# Altium project LAUNCHXL-CC1310.PrjPcb (part 4 of 4)

## Sheet 3_Debugger Interface.SchDoc
size 420 x 297 mm
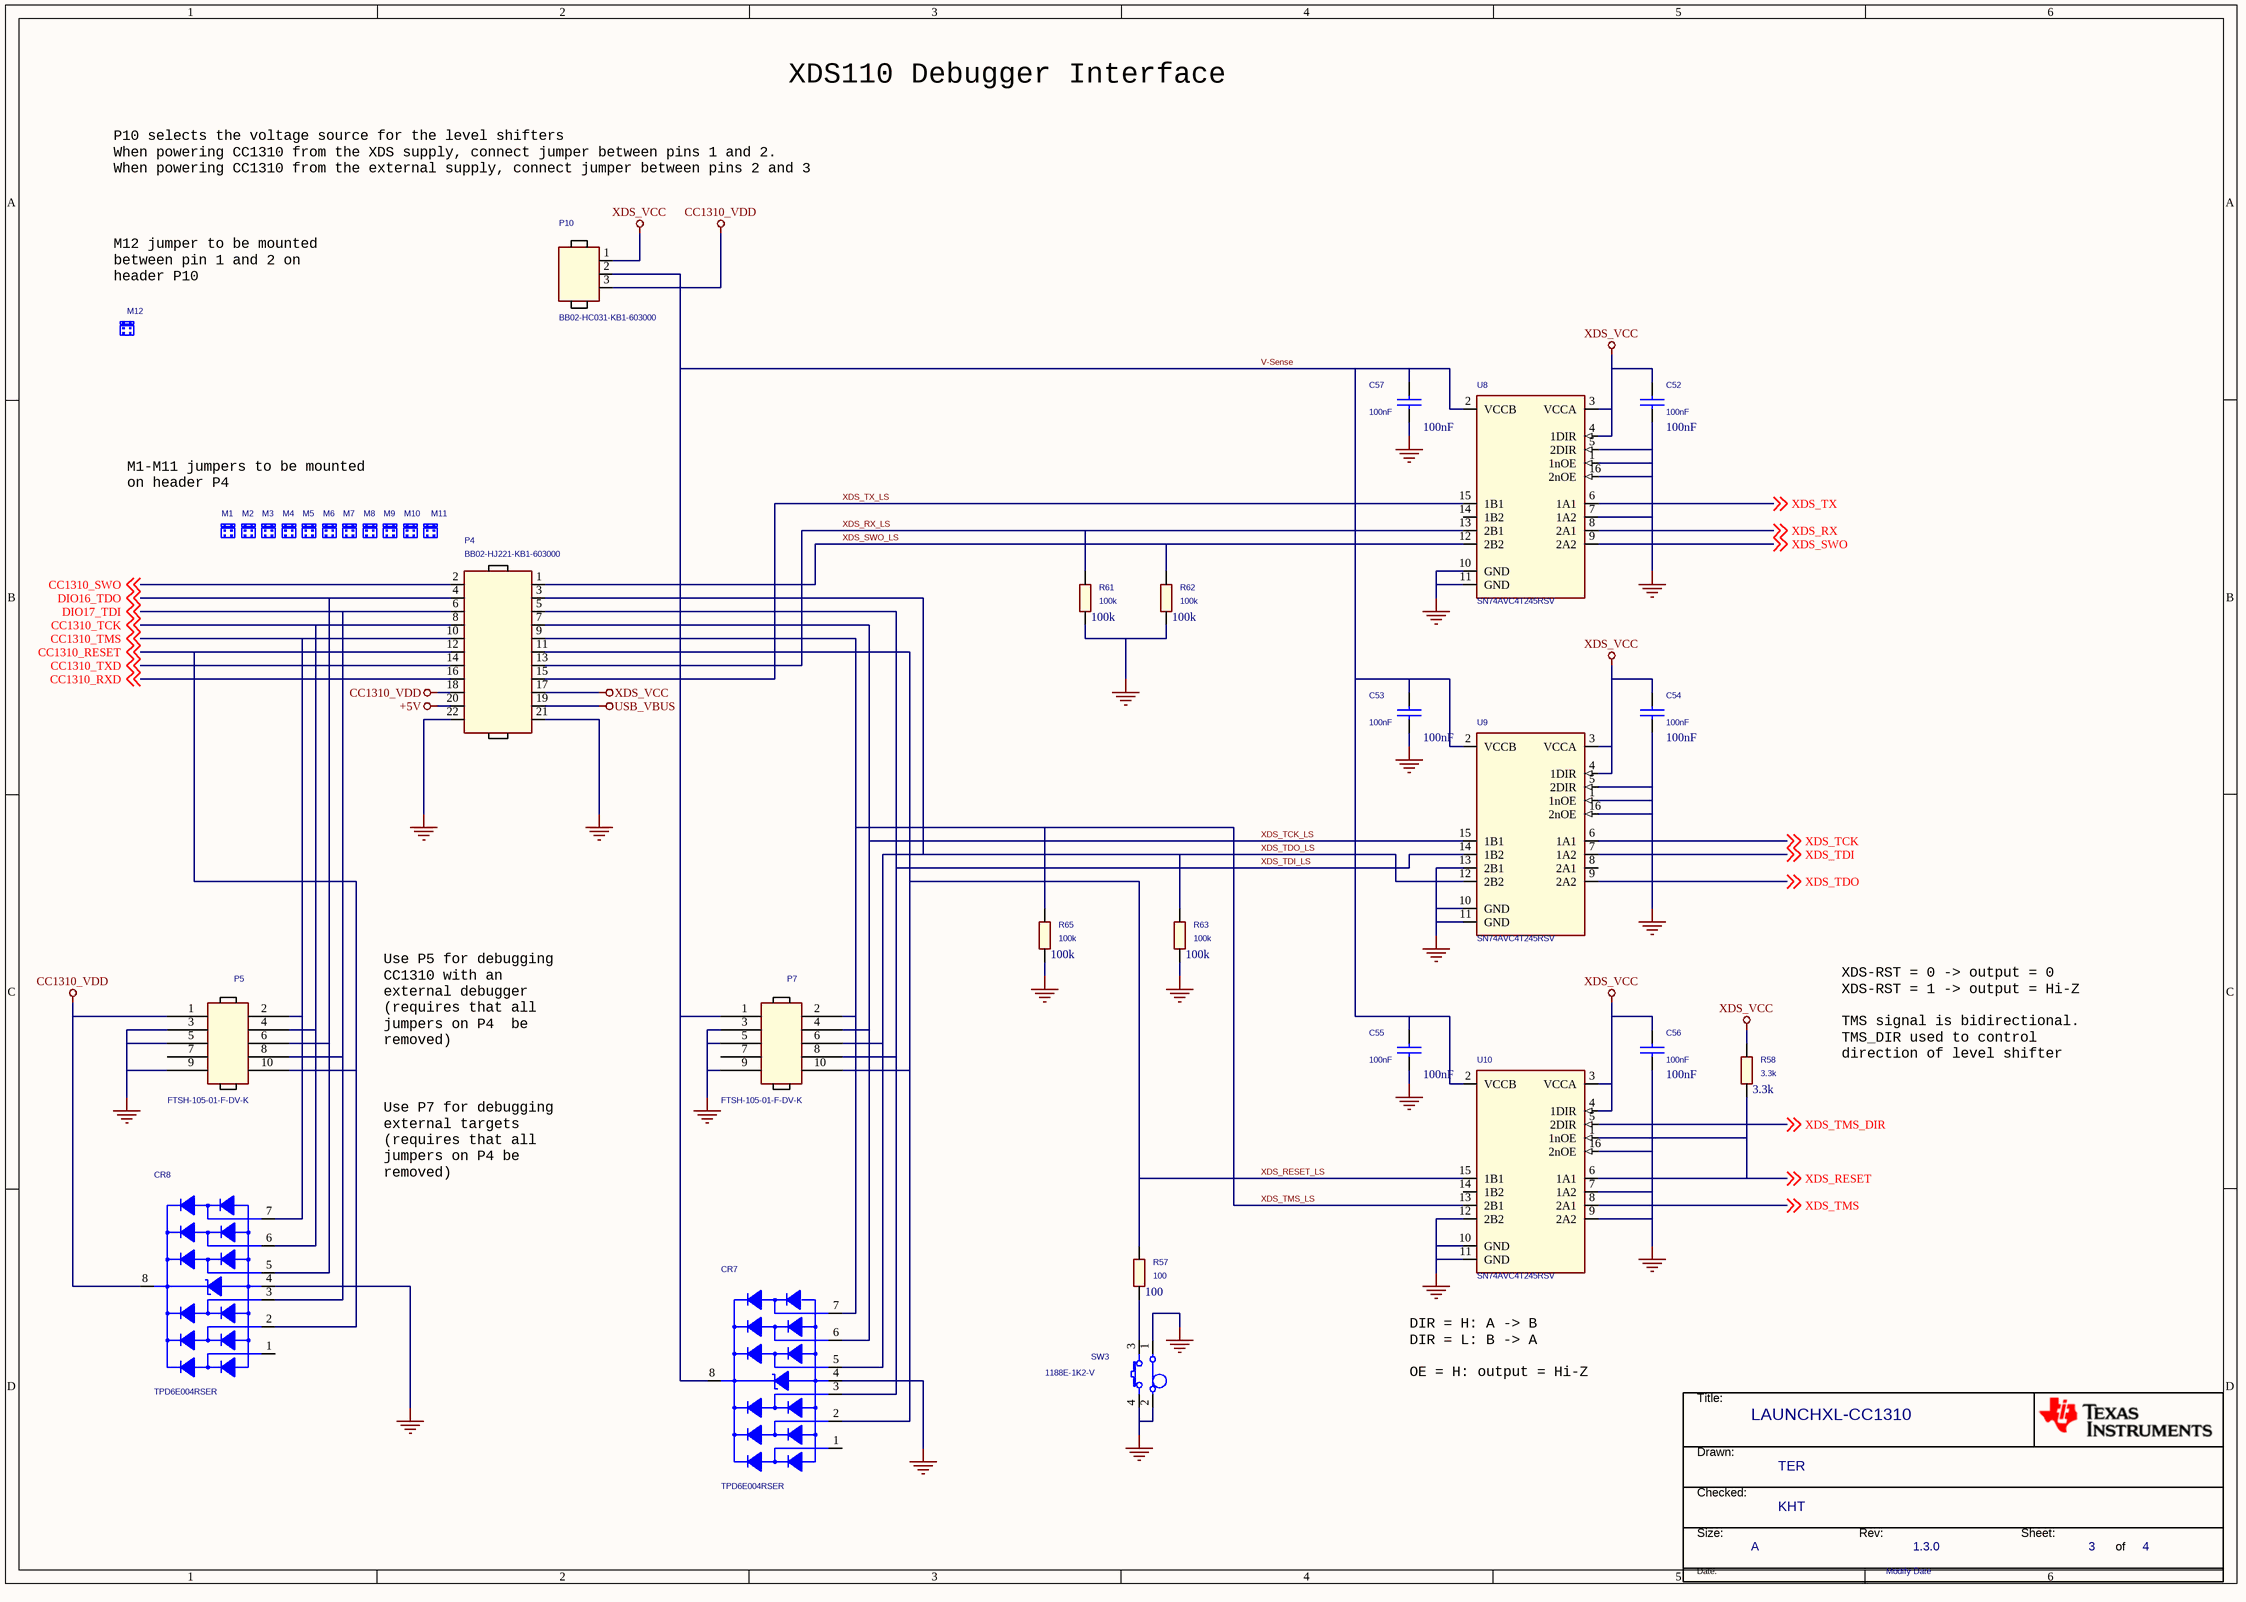
[diagram p3: 3_Debugger Interface.SchDoc]

### Parts
(Parts that share a designator on the sheet are numbered #1, #2 ... from top to bottom, then left to right.)
*#4  Designer name: KHT  Check name: TER  Design Modify Date: Modify Date  Page Size: A  RevCode: 1.3.0  Page Count: 4  Page Number: 3  Title: LAUNCHXL-CC1310  (hidden comment: TI_Norway_Title_Block)  (graphical)
C52  100nF  [CAPC1005X60B2N]
C53  100nF  [CAPC1005X60B2N]
C54  100nF  [CAPC1005X60B2N]
C55  100nF  [CAPC1005X60B2N]
C56  100nF  [CAPC1005X60B2N]
C57  100nF  [CAPC1005X60B2N]
CR7  TPD6E004RSER  [QFN50P150X150X60-8N]
CR8  TPD6E004RSER  [QFN50P150X150X60-8N]
M1  SNT-100-BK-G  (value not drawn)
M2  SNT-100-BK-G  (value not drawn)
M3  SNT-100-BK-G  (value not drawn)
M4  SNT-100-BK-G  (value not drawn)
M5  SNT-100-BK-G  (value not drawn)
M6  SNT-100-BK-G  (value not drawn)
M7  SNT-100-BK-G  (value not drawn)
M8  SNT-100-BK-G  (value not drawn)
M9  SNT-100-BK-G  (value not drawn)
M10  SNT-100-BK-G  (value not drawn)
M11  SNT-100-BK-G  (value not drawn)
M12  SNT-100-BK-G  (value not drawn)
P4  BB02-HJ221-KB1-603000  [GRADCONN_BB02HJ221KB160300_A2B]
P5  FTSH-105-01-F-DV-K  [SAMTEC_FTSH-105-01-F-DV-K-10L]
P7  FTSH-105-01-F-DV-K  [SAMTEC_FTSH-105-01-F-DV-K-10L]
P10  BB02-HC031-KB1-603000  [GRADCONN_BB02HC031KB1603000_A2B]
R57  100  [RESC1005X40B2N]
R58  3.3k  [RESC1005X40B2N]
R61  100k  [RESC1005X40B2N]
R62  100k  [RESC1005X40B2N]
R63  100k  [RESC1005X40B2N]
R65  100k  [RESC1005X40B2N]
SW3  1188E-1K2-V  [SW_1188E1K2V_A2N]
U8  SN74AVC4T245RSV  [QFNFC40P180X260X55-16A2L]
U9  SN74AVC4T245RSV  [QFNFC40P180X260X55-16A2L]
U10  SN74AVC4T245RSV  [QFNFC40P180X260X55-16A2L]

### Nets
+5V: P4.20
CC1310_VDD: CR8.8(VCC) P4.18 P5.1 P10.3
GND: C52.2 C53.2 C54.2 C55.2 C56.2 C57.2 CR7.4(GND) CR8.4(GND) P4.21 P4.22 P5.3 P5.5 P5.9 P7.3 P7.5 P7.9 R61.1 R62.1 R63.1 R65.1 SW3.1 SW3.2 SW3.4 U8.1(1nOE) U8.5(2DIR) U8.7(1A2) U8.10(GND) U8.11(GND) U8.16(2nOE) U9.1(1nOE) U9.5(2DIR) U9.10(GND) U9.11(GND) U9.13(2B1) U9.16(2nOE) U10.7(1A2) U10.9(2A2) U10.10(GND) U10.11(GND) U10.12(2B2) U10.16(2nOE)  [project net ITDI]
USB_VBUS: P4.19
XDS_VCC: C52.1 C54.1 C56.1 P4.17 P10.1 R58.2 U8.3(VCCA) U8.4(1DIR) U9.3(VCCA) U9.4(1DIR) U10.3(VCCA) U10.4(1DIR)
CC1310_RESET: CR8.2(IO2) P4.12 P5.10 ; off-sheet CC1310_RESET
CC1310_RXD: P4.16 ; off-sheet CC1310_RXD  [project net DIO2_RXD]
CC1310_SWO: P4.2 ; off-sheet CC1310_SWO  [project net DIO18_RTS/SWO]
CC1310_TCK: CR8.6(IO5) P4.8 P5.4 ; off-sheet CC1310_TCK
CC1310_TMS: CR8.7(IO6) P4.10 P5.2 ; off-sheet CC1310_TMS
CC1310_TXD: P4.14 ; off-sheet CC1310_TXD  [project net DIO3_TXD]
DIO16_TDO: CR8.5(IO4) P4.4 P5.6 ; off-sheet DIO16_TDO
DIO17_TDI: CR8.3(IO3) P4.6 P5.8 ; off-sheet DIO17_TDI
V-Sense: C53.1 C55.1 C57.1 CR7.8(VCC) P7.1 P10.2 U8.2(VCCB) U9.2(VCCB) U10.2(VCCB)
XDS_RESET: R58.1 U10.1(1nOE) U10.6(1A1) ; off-sheet XDS_RESET
XDS_RESET_LS: CR7.2(IO2) P4.11 P7.10 R57.2 U10.15(1B1)
XDS_RX: U8.8(2A1) ; off-sheet XDS_RX
XDS_RX_LS: P4.13 R61.2 U8.13(2B1)
XDS_SWO: U8.9(2A2) ; off-sheet XDS_SWO
XDS_SWO_LS: P4.1 R62.2 U8.12(2B2)
XDS_TCK: U9.6(1A1) ; off-sheet XDS_TCK
XDS_TCK_LS: CR7.6(IO5) P4.7 P7.4 U9.15(1B1)
XDS_TDI: U9.7(1A2) ; off-sheet XDS_TDI
XDS_TDI_LS: CR7.3(IO3) P4.5 P7.8 U9.14(1B2)
XDS_TDO: U9.9(2A2) ; off-sheet XDS_TDO
XDS_TDO_LS: CR7.5(IO4) P4.3 P7.6 R63.2 U9.12(2B2)
XDS_TMS: U10.8(2A1) ; off-sheet XDS_TMS
XDS_TMS_DIR: U10.5(2DIR) ; off-sheet XDS_TMS_DIR
XDS_TMS_LS: CR7.7(IO6) P4.9 P7.2 R65.2 U10.13(2B1)
XDS_TX: U8.6(1A1) ; off-sheet XDS_TX
XDS_TX_LS: P4.15 U8.15(1B1)
NetR57_1: R57.1 SW3.3

Not connected (* = marked no-connect by the designer): CR7 1(IO1); CR8 1(IO1); P5 7; P7 7; U8 14(1B2); U9 8(2A1); U10 14(1B2)

### Notes on the sheet
- P10 selects the voltage source for the level shifters
  When powering CC1310 from the XDS supply, connect jumper between pins 1 and 2.
  When powering CC1310 from the external supply, connect jumper between pins 2 and 3
- XDS110 Debugger Interface
- (near M12) M12 jumper to be mounted
  between pin 1 and 2 on
  header P10
- M1-M11 jumpers to be mounted
  on header P4
- Use P5 for debugging
  CC1310 with an
  external debugger
  (requires that all
  jumpers on P4  be
  removed)
- XDS-RST = 0 -> output = 0
  XDS-RST = 1 -> output = Hi-Z
  TMS signal is bidirectional.
  TMS_DIR used to control
  direction of level shifter
- Use P7 for debugging
  external targets
  (requires that all
  jumpers on P4 be
  removed)
- (near *#4) DIR = H: A -> B
  DIR = L: B -> A
  OE = H: output = Hi-Z
- (in symbol TI_Norway_Title_Block) Title:; Drawn:; Checked:; Size:; Rev:; Sheet:; of; Date:

### Library data of the parts
*#4 = TI_Norway_Title_Block: OrgName: Texas Instruments
C52 = CAPACITOR: CAPACITOR, CERAMIC X7R, 100nF, 6.3V, -10%/+10%, -55DEGC/+125DEGC, 0402, SMD; Part Number: 02-07610; Manufacturer: MANUFACTURER SELECTION; MPN: CAPACITOR_0402_100nF_X7R_M_+/-10%_10V; MPN Status: ACTIVE; Vendor Part Number: GRM155R70J104KA01D; Vendor Part Status: NRND; VOLTAGE: CMAX; CURRENT: CIMAX; KNEE: CBMAX; PSpiceTemplate: C^@REFDES %1 %2 ?TOLERANCE|C^@REFDES| @VALUE ?IC/IC=@IC/ TC=@TC1,@TC2 ?TOLERANCE|\n.model C^@REFDES CAP C=1 DEV=@TOLERANCE%|; DIST: FLAT; SLOPE: CSMAX; MAX_TEMP: CTMAX; TC1: 0; Definied Quality: INDUSTRIAL; Old Footprint: CAPC1005X60N; PCB Package: 0402; Max Tol: +10%; Min Tol: -10%; NOTE Status: PREFERRED; Lead Time: 14; Budget Price: 0.007; Budget Currency: EUR; Packing Size: 10000; Packing Type: TAPE_&_REEL; BU Name: TEXAS INSTRUMENTS NORWAY; Vendor: MURATA; TC2: 0; Value: 100nF; MSL: N/A; MTBF Standard: N/A; MTBF: N/A; Esd Level: N/A; Last Time Buy: N/A; Revision: R000; Mounting Type: SMD; Part Type: CAPACITOR\CERAMIC\0402\STANDARD; Max Oper Temp: +125DEGC; Min Oper Temp: -55DEGC; Rtd Voltage: 6.3V; Capacitance: 100nF; Dielectric Type: X7R; RoHS Status: ROHS_COMPLIANT; LifeCycle Status: ACTIVE; WEIGHT: 0.0016g; Datasheet URL 1: http://psearch.murata.com/capacitor/product/GRM155R70J104KA01%23.pdf; Datasheet URL 2: http://search.murata.co.jp/Ceramy/image/img/w_hinm/L0005E.pdf; AutoDoc File: https://notefied-dynamic-precision.com/DB/Apps/Desktop/Item/Object.aspx?id=113338; Country of Origin: PHILIPPINES
C53 C54 = CAPACITOR: CAPACITOR, CERAMIC X7R, 100nF, 6.3V, -10%/+10%, -55DEGC/+125DEGC, 0402, SMD; Vendor Part Status: NRND; Vendor Part Number: GRM155R70J104KA01D; Part Number: 02-07610; Manufacturer: MANUFACTURER SELECTION; MPN: CAPACITOR_0402_100nF_X7R_M_+/-10%_10V; MPN Status: ACTIVE; VOLTAGE: CMAX; CURRENT: CIMAX; KNEE: CBMAX; PSpiceTemplate: C^@REFDES %1 %2 ?TOLERANCE|C^@REFDES| @VALUE ?IC/IC=@IC/ TC=@TC1,@TC2 ?TOLERANCE|\n.model C^@REFDES CAP C=1 DEV=@TOLERANCE%|; DIST: FLAT; SLOPE: CSMAX; MAX_TEMP: CTMAX; TC1: 0; Vendor: MURATA; BU Name: TEXAS INSTRUMENTS NORWAY; Definied Quality: INDUSTRIAL; Old Footprint: CAPC1005X60N; PCB Package: 0402; Max Tol: +10%; Min Tol: -10%; NOTE Status: PREFERRED; Lead Time: 14; Budget Price: 0.007; Budget Currency: EUR; Packing Size: 10000; Packing Type: TAPE_&_REEL; TC2: 0; Value: 100nF; Country of Origin: PHILIPPINES; MSL: N/A; MTBF Standard: N/A; MTBF: N/A; Esd Level: N/A; Last Time Buy: N/A; Revision: R000; Mounting Type: SMD; Part Type: CAPACITOR\CERAMIC\0402\STANDARD; Max Oper Temp: +125DEGC; Min Oper Temp: -55DEGC; Rtd Voltage: 6.3V; Capacitance: 100nF; Dielectric Type: X7R; RoHS Status: ROHS_COMPLIANT; LifeCycle Status: ACTIVE; WEIGHT: 0.0016g; Datasheet URL 1: http://psearch.murata.com/capacitor/product/GRM155R70J104KA01%23.pdf; Datasheet URL 2: http://search.murata.co.jp/Ceramy/image/img/w_hinm/L0005E.pdf; AutoDoc File: https://notefied-dynamic-precision.com/DB/Apps/Desktop/Item/Object.aspx?id=113338
C55-C57 = CAPACITOR: CAPACITOR, CERAMIC X7R, 100nF, 6.3V, -10%/+10%, -55DEGC/+125DEGC, 0402, SMD; MPN Status: ACTIVE; MPN: CAPACITOR_0402_100nF_X7R_M_+/-10%_10V; Manufacturer: MANUFACTURER SELECTION; Part Number: 02-07610; Vendor Part Number: GRM155R70J104KA01D; Vendor Part Status: NRND; VOLTAGE: CMAX; CURRENT: CIMAX; KNEE: CBMAX; PSpiceTemplate: C^@REFDES %1 %2 ?TOLERANCE|C^@REFDES| @VALUE ?IC/IC=@IC/ TC=@TC1,@TC2 ?TOLERANCE|\n.model C^@REFDES CAP C=1 DEV=@TOLERANCE%|; DIST: FLAT; SLOPE: CSMAX; MAX_TEMP: CTMAX; TC1: 0; Packing Type: TAPE_&_REEL; Packing Size: 10000; Budget Currency: EUR; Budget Price: 0.007; Lead Time: 14; NOTE Status: PREFERRED; Min Tol: -10%; Max Tol: +10%; PCB Package: 0402; Old Footprint: CAPC1005X60N; Definied Quality: INDUSTRIAL; BU Name: TEXAS INSTRUMENTS NORWAY; Vendor: MURATA; TC2: 0; Value: 100nF; AutoDoc File: https://notefied-dynamic-precision.com/DB/Apps/Desktop/Item/Object.aspx?id=113338; Datasheet URL 2: http://search.murata.co.jp/Ceramy/image/img/w_hinm/L0005E.pdf; Datasheet URL 1: http://psearch.murata.com/capacitor/product/GRM155R70J104KA01%23.pdf; WEIGHT: 0.0016g; LifeCycle Status: ACTIVE; RoHS Status: ROHS_COMPLIANT; Dielectric Type: X7R; Capacitance: 100nF; Rtd Voltage: 6.3V; Min Oper Temp: -55DEGC; Max Oper Temp: +125DEGC; Part Type: CAPACITOR\CERAMIC\0402\STANDARD; Mounting Type: SMD; Revision: R000; Last Time Buy: N/A; Esd Level: N/A; MTBF: N/A; MTBF Standard: N/A; MSL: N/A; Country of Origin: PHILIPPINES
CR7 CR8 = DIODE_TVS_TPD6E004_QFN8_V1_0: DIODE, PROTECTION, ESD, 7V, -40DEGC/+85DEGC, QFN8, SMD; MPN Status: ACTIVE; Manufacturer: TEXAS INSTRUMENTS; Part Number: 14-05493; MTBF Standard: MTTF,CL=60%,Tu=55,Ea=0.7,Tt=125; MTBF: 9.9*10^8; Esd Level: HBM 15kV; Packing Type: TAPE_&_REEL; Packing Size: 3000; Definied Quality: INDUSTRIAL; Budget Currency: USD; Budget Price: 0.27; Lead Time: 6; NOTE Status: PREFERRED; Old Footprint: QFN50P150X150X60-8N,QFN50P150X150X60-8AN; ALT_SYMBOLS: QFN50P150X150X60-8L,QFN50P150X150X60-8M,QFN50P150X150X60-8AL; FPLIST: QFN50P150X150X60-8N,QFN50P150X150X60-8AN,QFN50P150X150X60-8L,QFN50P150X150X60-8M,QFN50P150X150X60-8AL; AutoDoc File: http://notefied-dynamic-precision.com/DB/Apps/Desktop/Item/Object.aspx?id=74721; Datasheet URL 2: http://www.ti.com/lit/ds/symlink/tpd6e004.pdf; Datasheet URL 1: N/A; MSL: 1; WEIGHT: 0.0027g; Last Time Buy: N/A; LifeCycle Status: MATURITY; RoHS Status: ROHS_COMPLIANT; MPN: TPD6E004RSER; Rtd Voltage: 7V; Min Oper Temp: -40DEGC; Max Oper Temp: +85DEGC; Part Type: DIODE\PROTECTION; Mounting Type: SMD; PCB Package: QFN8; Revision: R001
M1-M10 M12 = MECH_SHUNT_JUMPER: MECHANIC, SHUNT, CURRENT RATING 4.3A PER PIN, 2.54 X 5.08 X 6.1mm, BLACK; MPN Status: ACTIVE; Manufacturer: SAMTEC; Part Number: 19-00498; Designed_By: Artur Bielinski; CLASS: DISCRETE; Packing Type: BULK; Packing Size: 1; Definied Quality: INDUSTRIAL; Budget Currency: USD; Budget Price: 0.146; NOTE Status: PREFERRED; Min Oper Temp: -55DEGC; Max Oper Temp: +125DEGC; Mounting Type: NOT APPLY; Design_Date: 2015-03-18; AutoDoc File: http://notefied-dynamic-precision.com/DB/Apps/Desktop/Item/Object.aspx?id=104092; Datasheet URL 2: http://suddendocs.samtec.com/catalog_english/snt.pdf; Datasheet URL 1: http://suddendocs.samtec.com/prints/snt-100-xx-x-x-mkt.pdf; MSL: N/A; MTBF Standard: N/A; MTBF: N/A; Esd Level: N/A; WEIGHT: N/A; Last Time Buy: N/A; Lead Time: 1; LifeCycle Status: ACTIVE; RoHS Status: ROHS_COMPLIANT; MPN: SNT-100-BK-G; Rtd Current: 4.3A; Part Type: MECHANIC\SHUNT; Revision: R001
M11 = MECH_SHUNT_JUMPER: MECHANIC, SHUNT, CURRENT RATING 4.3A PER PIN, 2.54 X 5.08 X 6.1mm, BLACK; Part Number: 19-00498; Manufacturer: SAMTEC; MPN Status: ACTIVE; Designed_By: Artur Bielinski; CLASS: DISCRETE; Mounting Type: NOT APPLY; Max Oper Temp: +125DEGC; Min Oper Temp: -55DEGC; NOTE Status: PREFERRED; Lead Time: 1; Budget Price: 0.146; Budget Currency: USD; Definied Quality: INDUSTRIAL; Packing Type: BULK; Design_Date: 2015-03-18; Revision: R001; Part Type: MECHANIC\SHUNT; Rtd Current: 4.3A; MPN: SNT-100-BK-G; RoHS Status: ROHS_COMPLIANT; LifeCycle Status: ACTIVE; Last Time Buy: N/A; Packing Size: 1; WEIGHT: N/A; Esd Level: N/A; MTBF: N/A; MTBF Standard: N/A; MSL: N/A; Datasheet URL 1: http://suddendocs.samtec.com/prints/snt-100-xx-x-x-mkt.pdf; Datasheet URL 2: http://suddendocs.samtec.com/catalog_english/snt.pdf; AutoDoc File: http://notefied-dynamic-precision.com/DB/Apps/Desktop/Item/Object.aspx?id=104092
P4 = CONN_HEADER_2X11_P_S: CONNECTOR, HEADER, MALE, STRAIGHT, 2 ROWS, 22 PINS, PITCH 2.54mm, PTH; MPN Status: ACTIVE; Manufacturer: GRADCONN; Part Number: 06-05049; Definied Quality: INDUSTRIAL; NOTE Status: PREFERRED; No Of Rows: 2; No Of Pos: 22; Rtd Current: 3A; Rtd Voltage: 600VAC; Min Oper Temp: -40DEGC; Max Oper Temp: +105DEGC; ALT_SYMBOLS: GRADCONN_BB02HJ221KB160300_A2C,GRADCONN_BB02HJ221KB160300_A2A; AutoDoc File: http://notefied-dynamic-precision.com/DB/Apps/Desktop/Item/Object.aspx?id=105022; Datasheet URL 2: http://www.gradconn.com/Files/Specs/BTB-2.54mm-Header-specification.pdf; Datasheet URL 1: http://www.gradconn.com/Files/Drawings/BB02-HJ.pdf; RoHS Status: ROHS_COMPLIANT; MPN: BB02-HJ221-KB1-603000; Pitch: 2.54mm; Part Type: CONNECTOR\HEADER; Mounting Type: PTH; Old Footprint: GRADCONN_BB02HJ221KB160300_A2B; Revision: R001
P5 P7 = CONN_HEADER_2X5: CONNECTOR, HEADER, MALE, STRAIGHT, 10 PINS, 2 ROWS, PITCH 1.27mm, SMD; MPN Status: ACTIVE; Manufacturer: SAMTEC; Part Number: 06-00166; Packing Type: TUBE; Packing Size: 92; Budget Currency: USD; Budget Price: 1.700; Lead Time: 2; NOTE Status: PREFERRED; No Of Pos: 10; Rtd Current: 1.75A; Min Oper Temp: -55DEGC; Max Oper Temp: +125DEGC; Old Footprint: SAMTEC_FTSH-105-01-F-DV-K-10N,CONN_MALE_2X5; ALT_SYMBOLS: SAMTEC_FTSH-105-01-F-DV-K-10L,SAMTEC_FTSH-105-01-F-DV-K-10M; FPLIST: SAMTEC_FTSH-105-01-F-DV-K-10N,SAMTEC_FTSH-105-01-F-DV-K-10L,SAMTEC_FTSH-105-01-F-DV-K-10M; AutoDoc File: http://notefied-dynamic-precision.com/DB/Apps/Desktop/Item/Object.aspx?id=50836; Datasheet URL 2: http://www.samtec.com/documents/webfiles/pdf/FTSH_SMT.PDF; Datasheet URL 1: http://www.samtec.com/documents/webfiles/cpdf/FTSH-1XX-XX-XXX-DV-XXX-MKT.pdf; WEIGHT: 0.65614g; LifeCycle Status: MATURITY; RoHS Status: ROHS_COMPLIANT; MPN: FTSH-105-01-F-DV-K; No Of Rows: 2; Pitch: 1.27mm; Part Type: CONNECTOR\HEADER; Mounting Type: SMD; Revision: R003
P10 = CONN_HEADER_3_P_S: CONNECTOR, HEADER, MALE, STRAIGHT, 1 ROW, 3 PINS, PITCH 2.54mm, PTH; MPN Status: ACTIVE; Manufacturer: GRADCONN; Part Number: 06-05038; CLASS: IO; NOTE Status: PREFERRED; No Of Rows: 1; No Of Pos: 3; Rtd Current: 3A; Rtd Voltage: 250V; Min Oper Temp: -40DEGC; Max Oper Temp: +105DEGC; ALT_SYMBOLS: GRADCONN_BB02HC031KB1603000_A2C,GRADCONN_BB02HC031KB1603000_A2A; AutoDoc File: http://notefied-dynamic-precision.com/DB/Apps/Desktop/Item/Object.aspx?id=104636; Datasheet URL 2: http://www.gradconn.com/Files/Specs/BTB-2.54mm-Header-specification.pdf; Datasheet URL 1: http://www.gradconn.com/Files/Drawings/BB02-HC.pdf; RoHS Status: ROHS_COMPLIANT; MPN: BB02-HC031-KB1-603000; Pitch: 2.54mm; Part Type: CONNECTOR\HEADER; Mounting Type: PTH; Old Footprint: GRADCONN_BB02HC031KB1603000_A2B; Revision: R001
R57 = RESISTOR: RESISTOR, THICK FILM, 100, -5%/+5%, 0.063W, 50V, -55DEGC/+155DEGC, 0402, SMD; Part Number: 01-22343; Manufacturer: MANUFACTURER SELECTION; MPN: RESISTOR_0402_100_+/-5%_50V_0.063W_M_+/-200ppm; MPN Status: ACTIVE; PSpiceTemplate: R^@REFDES %1 %2 ?TOLERANCE|R^@REFDES| @VALUE TC=@TC1,@TC2 ?TOLERANCE|\n.model R^@REFDES RES R=1 DEV=@TOLERANCE%|; VOLTAGE: RVMAX; DIST: FLAT; MAX_TEMP: RTMAX; TC1: 0; POWER: RMAX; Old Footprint: RESC1005X40N; PCB Package: 0402; Max Tol: +5%; Min Tol: -5%; Max TC: +200PPM/DEGC; Min TC: -200PPM/DEGC; NOTE Status: PREFERRED; Budget Price: 0.00244; Budget Currency: USD; Definied Quality: INDUSTRIAL; Packing Size: 10000; Packing Type: TAPE_&_REEL; BU Name: TEXAS INSTRUMENTS NORWAY; TC2: 0; Value: 100; Revision: R000; Mounting Type: SMD; Part Type: RESISTOR\0402\STANDARD; Max Oper Temp: +155DEGC; Min Oper Temp: -55DEGC; Rtd Voltage: 50V; Rtd Current: N/A; Rtd Power: 0.063W; Resistance: 100; Resistor Type: THICK FILM; RoHS Status: ROHS_COMPLIANT; LifeCycle Status: ACTIVE; Lead Time: N/A; Last Time Buy: N/A; WEIGHT: N/A; Esd Level: N/A; MTBF: N/A; MTBF Standard: N/A; MSL: N/A; Datasheet URL 1: N/A; Datasheet URL 2: N/A; AutoDoc File: https://notefied-dynamic-precision.com/DB/Apps/Desktop/Item/Object.aspx?id=113316; Vendor: MANUFACTURER SELECTION; Vendor Part Number: RESISTOR_0402_100_+/-5%_50V_0.063W_M_+/-200ppm; Vendor Part Status: ACTIVE; Country of Origin: MISSING INFO
R58 = RESISTOR: RESISTOR, THICK FILM, 3.3k, -5%/+5%, 0.063W, 50V, -55DEGC/+155DEGC, 0402, SMD; Part Number: 01-22351; Manufacturer: MANUFACTURER SELECTION; MPN: RESISTOR_0402_3.3k_+/-5%_50V_0.063W_M_+/-200ppm; MPN Status: ACTIVE; PSpiceTemplate: R^@REFDES %1 %2 ?TOLERANCE|R^@REFDES| @VALUE TC=@TC1,@TC2 ?TOLERANCE|\n.model R^@REFDES RES R=1 DEV=@TOLERANCE%|; VOLTAGE: RVMAX; DIST: FLAT; MAX_TEMP: RTMAX; TC1: 0; POWER: RMAX; Old Footprint: RESC1005X40N; PCB Package: 0402; Max Tol: +5%; Min Tol: -5%; Max TC: +200PPM/DEGC; Min TC: -200PPM/DEGC; NOTE Status: PREFERRED; Budget Price: 0.00244; Budget Currency: USD; Definied Quality: INDUSTRIAL; Packing Size: 10000; Packing Type: TAPE_&_REEL; BU Name: TEXAS INSTRUMENTS NORWAY; TC2: 0; Value: 3.3k; Revision: R000; Mounting Type: SMD; Part Type: RESISTOR\0402\STANDARD; Max Oper Temp: +155DEGC; Min Oper Temp: -55DEGC; Rtd Voltage: 50V; Rtd Current: N/A; Rtd Power: 0.063W; Resistance: 3.3k; Resistor Type: THICK FILM; RoHS Status: ROHS_COMPLIANT; LifeCycle Status: ACTIVE; Lead Time: N/A; Last Time Buy: N/A; WEIGHT: N/A; Esd Level: N/A; MTBF: N/A; MTBF Standard: N/A; MSL: N/A; Datasheet URL 1: N/A; Datasheet URL 2: N/A; AutoDoc File: https://notefied-dynamic-precision.com/DB/Apps/Desktop/Item/Object.aspx?id=113324; Vendor: MANUFACTURER SELECTION; Vendor Part Number: RESISTOR_0402_3.3k_+/-5%_50V_0.063W_M_+/-200ppm; Vendor Part Status: ACTIVE; Country of Origin: MISSING INFO
R61 R65 = RESISTOR: RESISTOR, THICK FILM, 100k, -5%/+5%, 0.063W, 50V, -55DEGC/+155DEGC, 0402, SMD; MPN Status: ACTIVE; MPN: RESISTOR_0402_100k_+/-1%_50V_0.063W_M_+/-100PPM; Manufacturer: MANUFACTURER SELECTION; Part Number: 01-22356; Vendor Part Number: RESISTOR_0402_100k_+/-5%_50V_0.063W_M_+/-200ppm; PSpiceTemplate: R^@REFDES %1 %2 ?TOLERANCE|R^@REFDES| @VALUE TC=@TC1,@TC2 ?TOLERANCE|\n.model R^@REFDES RES R=1 DEV=@TOLERANCE%|; VOLTAGE: RVMAX; DIST: FLAT; MAX_TEMP: RTMAX; TC1: 0; POWER: RMAX; Packing Type: TAPE_&_REEL; Packing Size: 10000; Definied Quality: INDUSTRIAL; Budget Currency: USD; Budget Price: 0.00244; NOTE Status: PREFERRED; Min TC: -200PPM/DEGC; Max TC: +200PPM/DEGC; Min Tol: -5%; Max Tol: +5%; PCB Package: 0402; Old Footprint: RESC1005X40N; BU Name: TEXAS INSTRUMENTS NORWAY; TC2: 0; Value: 100k; AutoDoc File: https://notefied-dynamic-precision.com/DB/Apps/Desktop/Item/Object.aspx?id=113329; Datasheet URL 2: N/A; Datasheet URL 1: N/A; MSL: N/A; MTBF Standard: N/A; MTBF: N/A; Esd Level: N/A; WEIGHT: N/A; Last Time Buy: N/A; Lead Time: N/A; LifeCycle Status: ACTIVE; RoHS Status: ROHS_COMPLIANT; Resistor Type: THICK FILM; Resistance: 100k; Rtd Power: 0.063W; Rtd Voltage: 50V; Min Oper Temp: -55DEGC; Max Oper Temp: +155DEGC; Part Type: RESISTOR\0402\STANDARD; Mounting Type: SMD; Revision: R000; Rtd Current: N/A; Vendor: MANUFACTURER SELECTION; Vendor Part Status: ACTIVE; Country of Origin: MISSING INFO
R62 R63 = RESISTOR: RESISTOR, THICK FILM, 100k, -5%/+5%, 0.063W, 50V, -55DEGC/+155DEGC, 0402, SMD; Part Number: 01-22356; Manufacturer: MANUFACTURER SELECTION; MPN: RESISTOR_0402_100k_+/-1%_50V_0.063W_M_+/-100PPM; MPN Status: ACTIVE; Vendor Part Number: RESISTOR_0402_100k_+/-5%_50V_0.063W_M_+/-200ppm; PSpiceTemplate: R^@REFDES %1 %2 ?TOLERANCE|R^@REFDES| @VALUE TC=@TC1,@TC2 ?TOLERANCE|\n.model R^@REFDES RES R=1 DEV=@TOLERANCE%|; VOLTAGE: RVMAX; DIST: FLAT; MAX_TEMP: RTMAX; TC1: 0; POWER: RMAX; Old Footprint: RESC1005X40N; PCB Package: 0402; Max Tol: +5%; Min Tol: -5%; Max TC: +200PPM/DEGC; Min TC: -200PPM/DEGC; NOTE Status: PREFERRED; Budget Price: 0.00244; Budget Currency: USD; Definied Quality: INDUSTRIAL; Packing Size: 10000; Packing Type: TAPE_&_REEL; BU Name: TEXAS INSTRUMENTS NORWAY; TC2: 0; Value: 100k; Revision: R000; Mounting Type: SMD; Part Type: RESISTOR\0402\STANDARD; Max Oper Temp: +155DEGC; Min Oper Temp: -55DEGC; Rtd Voltage: 50V; Rtd Power: 0.063W; Resistance: 100k; Resistor Type: THICK FILM; RoHS Status: ROHS_COMPLIANT; LifeCycle Status: ACTIVE; Lead Time: N/A; Last Time Buy: N/A; WEIGHT: N/A; Esd Level: N/A; MTBF: N/A; MTBF Standard: N/A; MSL: N/A; Datasheet URL 1: N/A; Datasheet URL 2: N/A; AutoDoc File: https://notefied-dynamic-precision.com/DB/Apps/Desktop/Item/Object.aspx?id=113329; Rtd Current: N/A; Vendor: MANUFACTURER SELECTION; Vendor Part Status: ACTIVE; Country of Origin: MISSING INFO
SW3 = SWITCH_TACT_V2: SWITCH, TACT, 0.05A@250VAC, 0.05A@12VDC, 0.05A, 250V, SMD; Part Number: 08-00293; Manufacturer: DIPTRONICS; MPN: 1188E-1K2-V-TR; MPN Status: ACTIVE; Designed_By: Artur Bielinski; CLASS: DISCRETE; FPLIST: SW_1188E1K2V_A2N,SW_1188E1K2V_A2L,SW_1188E1K2V_A2M; ALT_SYMBOLS: SW_1188E1K2V_A2L,SW_1188E1K2V_A2M; Max Oper Temp: +70DEGC; Min Oper Temp: -25DEGC; Rtd Voltage: 12V; NOTE Status: PREFERRED; Packing Size: 1500; Packing Type: TAPE_&_REEL; Design_Date: 2014-08-07; Revision: R001; Old Footprint: SW_1188E1K2V_A2N; Mounting Type: SMD; Part Type: SWITCH\TACT; Rtd Current: 0.05A; RoHS Status: ROHS_COMPLIANT; Datasheet URL 1: N/A; Datasheet URL 2: http://www.dip.com.tw/en/en-product-information/en-switch004; AutoDoc File: http://notefied-dynamic-precision.com/DB/Apps/Desktop/Item/Object.aspx?id=104642
U8 U9 = IC_XCVR_SN74AVC4T245_UQFN16_2: IC, DIGITAL, LOGIC, 4bit DUAL-SUPPLY BUS TRANSCEIVER 3 STATE OUTPUT, 1.2V TO 3.6V, UQFN16, SMD; MPN Status: ACTIVE; MPN: SN74AVC4T245RSVR; Manufacturer: TEXAS INSTRUMENTS; Part Number: 18-29288; Designed_By: Artur Bielinski; Packing Type: TAPE_&_REEL; Packing Size: 3000; Definied Quality: INDUSTRIAL; Budget Currency: USD; Budget Price: 0.39; Lead Time: 8; NOTE Status: PREFERRED; Min Oper Temp: -40DEGC; Max Oper Temp: +85DEGC; Old Footprint: QFNFC40P180X260X55-16A2N; ALT_SYMBOLS: QFNFC40P180X260X55-16A2L,QFNFC40P180X260X55-16A2M; FPLIST: QFNFC40P180X260X55-16A2N,QFNFC40P180X260X55-16A2L,QFNFC40P180X260X55-16A2M; Design_Date: 2014-03-21; AutoDoc File: http://notefied-dynamic-precision.com/DB/Apps/Desktop/Item/Object.aspx?id=95718; Datasheet URL 2: http://www.ti.com/lit/ds/symlink/sn74avc4t245.pdf; Datasheet URL 1: http://www.ti.com/litv/pdf/mpqf205c; MSL: 1; WEIGHT: 0.0062g; Last Time Buy: N/A; LifeCycle Status: ACTIVE; RoHS Status: ROHS_COMPLIANT; Rtd Voltage: 1.2V TO 3.6V; Part Type: IC\DIGITAL\LOGIC\TRANSCEIVER; Mounting Type: SMD; PCB Package: UQFN16; Revision: R002
U10 = IC_XCVR_SN74AVC4T245_UQFN16_2: IC, DIGITAL, LOGIC, 4bit DUAL-SUPPLY BUS TRANSCEIVER 3 STATE OUTPUT, 1.2V TO 3.6V, UQFN16, SMD; Part Number: 18-29288; Manufacturer: TEXAS INSTRUMENTS; MPN: SN74AVC4T245RSVR; MPN Status: ACTIVE; Designed_By: Artur Bielinski; FPLIST: QFNFC40P180X260X55-16A2N,QFNFC40P180X260X55-16A2L,QFNFC40P180X260X55-16A2M; ALT_SYMBOLS: QFNFC40P180X260X55-16A2L,QFNFC40P180X260X55-16A2M; Old Footprint: QFNFC40P180X260X55-16A2N; Max Oper Temp: +85DEGC; Min Oper Temp: -40DEGC; NOTE Status: PREFERRED; Lead Time: 8; Budget Price: 0.39; Budget Currency: USD; Definied Quality: INDUSTRIAL; Packing Size: 3000; Packing Type: TAPE_&_REEL; Design_Date: 2014-03-21; Revision: R002; PCB Package: UQFN16; Mounting Type: SMD; Part Type: IC\DIGITAL\LOGIC\TRANSCEIVER; Rtd Voltage: 1.2V TO 3.6V; RoHS Status: ROHS_COMPLIANT; LifeCycle Status: ACTIVE; Last Time Buy: N/A; WEIGHT: 0.0062g; MSL: 1; Datasheet URL 1: http://www.ti.com/litv/pdf/mpqf205c; Datasheet URL 2: http://www.ti.com/lit/ds/symlink/sn74avc4t245.pdf; AutoDoc File: http://notefied-dynamic-precision.com/DB/Apps/Desktop/Item/Object.aspx?id=95718

## Nets that join several sheets
+5V: 2_Peripherals (J1.2 P2.1), 3_Debugger Interface (P4.20)
CC1310_VDD: 1_CC1310RF (FL1.2), 2_Peripherals (9 pins), 3_Debugger Interface (CR8.8 P4.18 P5.1 P10.3)
ITDI: 1_CC1310RF (25 pins), 2_Peripherals (20 pins), 4_XDS110 (50 pins), 3_Debugger Interface (41 pins)
USB_VBUS: 4_XDS110 (8 pins), 3_Debugger Interface (P4.19)
XDS_VCC: 4_XDS110 (35 pins), 3_Debugger Interface (12 pins)
CC1310_RESET: 1_CC1310RF (C20.1 R1.1 U1.35), 2_Peripherals (R51.2 R52.1), 3_Debugger Interface (CR8.2 P4.12 P5.10)
CC1310_TCK: 1_CC1310RF (U1.25), 2_Peripherals (R47.2), 3_Debugger Interface (CR8.6 P4.8 P5.4)
CC1310_TMS: 1_CC1310RF (U1.24), 2_Peripherals (R46.2), 3_Debugger Interface (CR8.7 P4.10 P5.2)
DIO2_RXD: 2_Peripherals (J1.7 U1.7), 3_Debugger Interface (P4.16)
DIO3_TXD: 2_Peripherals (J1.5 U1.8), 3_Debugger Interface (P4.14)
DIO16_TDO: 2_Peripherals (R48.2 U1.26), 3_Debugger Interface (CR8.5 P4.4 P5.6)
DIO17_TDI: 2_Peripherals (R49.2 U1.27), 3_Debugger Interface (CR8.3 P4.6 P5.8)
DIO18_RTS/SWO: 2_Peripherals (J2.9 U1.28), 3_Debugger Interface (P4.2)
XDS_RESET: 4_XDS110 (U5.40), 3_Debugger Interface (R58.1 U10.1 U10.6)
XDS_RX: 4_XDS110 (U5.33), 3_Debugger Interface (U8.8)
XDS_SWO: 4_XDS110 (U5.25), 3_Debugger Interface (U8.9)
XDS_TCK: 4_XDS110 (U5.35), 3_Debugger Interface (U9.6)
XDS_TDI: 4_XDS110 (U5.38), 3_Debugger Interface (U9.7)
XDS_TDO: 4_XDS110 (U5.37), 3_Debugger Interface (U9.9)
XDS_TMS: 4_XDS110 (U5.36), 3_Debugger Interface (U10.8)
XDS_TMS_DIR: 4_XDS110 (U5.24), 3_Debugger Interface (U10.5)
XDS_TX: 4_XDS110 (U5.34), 3_Debugger Interface (U8.6)